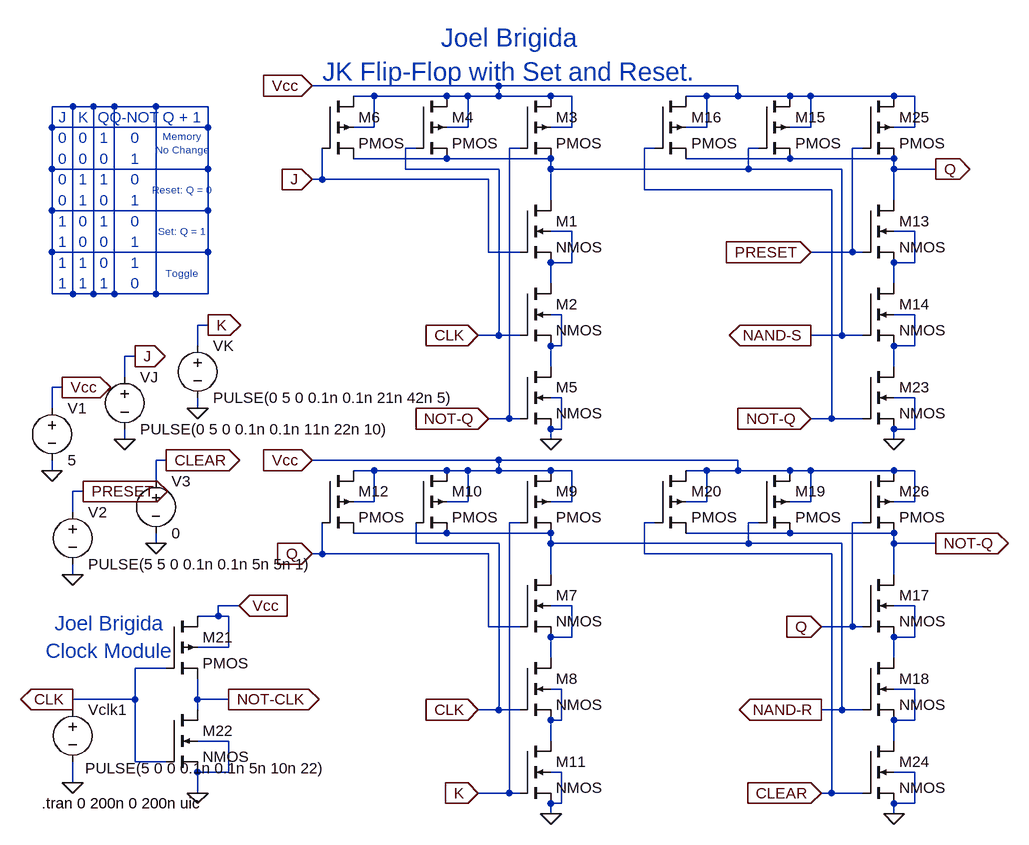
[diagram p0: schematic JKFlipFlop.asc]
JKFlipFlop.asc, the LTspice schematic file:
Version 4
SHEET 1 880 876
WIRE -288 -256 -576 -256
WIRE 80 -256 -288 -256
WIRE -480 -240 -512 -240
WIRE -368 -240 -480 -240
WIRE -336 -240 -368 -240
WIRE -288 -240 -288 -256
WIRE -288 -240 -336 -240
WIRE -208 -240 -288 -240
WIRE -176 -240 -208 -240
WIRE 32 -240 0 -240
WIRE 80 -240 80 -256
WIRE 80 -240 32 -240
WIRE 160 -240 80 -240
WIRE 192 -240 160 -240
WIRE 320 -240 192 -240
WIRE 352 -240 320 -240
WIRE -944 -224 -976 -224
WIRE -912 -224 -944 -224
WIRE -880 -224 -912 -224
WIRE -816 -224 -880 -224
WIRE -736 -224 -816 -224
WIRE -976 -192 -976 -224
WIRE -736 -192 -736 -224
WIRE -736 -192 -976 -192
WIRE -480 -192 -480 -240
WIRE -480 -192 -512 -192
WIRE -336 -192 -336 -240
WIRE -336 -192 -368 -192
WIRE -176 -192 -176 -240
WIRE -176 -192 -208 -192
WIRE 32 -192 32 -240
WIRE 32 -192 0 -192
WIRE 192 -192 192 -240
WIRE 192 -192 160 -192
WIRE 352 -192 352 -240
WIRE 352 -192 320 -192
WIRE -416 -160 -432 -160
WIRE -256 -160 -272 -160
WIRE -48 -160 -64 -160
WIRE 112 -160 96 -160
WIRE 272 -160 256 -160
WIRE -368 -144 -512 -144
WIRE -208 -144 -368 -144
WIRE 160 -144 0 -144
WIRE 320 -144 160 -144
WIRE -976 -128 -976 -192
WIRE -736 -128 -736 -192
WIRE -736 -128 -976 -128
WIRE -432 -128 -432 -160
WIRE -288 -128 -432 -128
WIRE -208 -128 -208 -144
WIRE 96 -128 96 -160
WIRE 96 -128 -208 -128
WIRE 240 -128 96 -128
WIRE 320 -128 320 -144
WIRE 384 -128 320 -128
WIRE -560 -112 -560 -160
WIRE -560 -112 -576 -112
WIRE -304 -112 -560 -112
WIRE -64 -96 -64 -160
WIRE 224 -96 -64 -96
WIRE -208 -80 -208 -128
WIRE 320 -80 320 -128
WIRE -976 -64 -976 -128
WIRE -736 -64 -736 -128
WIRE -736 -64 -976 -64
WIRE -176 -32 -208 -32
WIRE 352 -32 320 -32
WIRE -976 0 -976 -64
WIRE -736 0 -736 -64
WIRE -736 0 -976 0
WIRE -304 0 -304 -112
WIRE -256 0 -304 0
WIRE 256 0 256 -160
WIRE 256 0 192 0
WIRE 272 0 256 0
WIRE -176 16 -176 -32
WIRE -176 16 -208 16
WIRE 352 16 352 -32
WIRE 352 16 320 16
WIRE -208 48 -208 16
WIRE 320 48 320 16
WIRE -976 64 -976 0
WIRE -944 64 -944 -224
WIRE -944 64 -976 64
WIRE -912 64 -912 -224
WIRE -912 64 -944 64
WIRE -880 64 -880 -224
WIRE -880 64 -912 64
WIRE -816 64 -816 -224
WIRE -816 64 -880 64
WIRE -736 64 -736 0
WIRE -736 64 -816 64
WIRE -192 96 -208 96
WIRE 352 96 320 96
WIRE -736 112 -752 112
WIRE -288 128 -288 -128
WIRE -288 128 -320 128
WIRE -256 128 -288 128
WIRE 240 128 240 -128
WIRE 240 128 192 128
WIRE 272 128 240 128
WIRE -752 144 -752 112
WIRE -192 144 -192 96
WIRE -192 144 -208 144
WIRE 352 144 352 96
WIRE 352 144 320 144
WIRE -848 160 -864 160
WIRE -208 176 -208 144
WIRE 320 176 320 144
WIRE -864 192 -864 160
WIRE -960 208 -976 208
WIRE -192 224 -208 224
WIRE 352 224 320 224
WIRE -976 240 -976 208
WIRE -752 240 -752 224
WIRE -272 256 -272 -160
WIRE -272 256 -304 256
WIRE -256 256 -272 256
WIRE 224 256 224 -96
WIRE 224 256 192 256
WIRE 272 256 224 256
WIRE -192 272 -192 224
WIRE -192 272 -208 272
WIRE 352 272 352 224
WIRE 352 272 320 272
WIRE -864 288 -864 272
WIRE -208 288 -208 272
WIRE 320 288 320 272
WIRE -800 320 -816 320
WIRE -288 320 -576 320
WIRE 80 320 -288 320
WIRE -976 336 -976 320
WIRE -480 336 -512 336
WIRE -368 336 -480 336
WIRE -336 336 -368 336
WIRE -288 336 -288 320
WIRE -288 336 -336 336
WIRE -208 336 -288 336
WIRE -176 336 -208 336
WIRE 32 336 0 336
WIRE 80 336 80 320
WIRE 80 336 32 336
WIRE 160 336 80 336
WIRE 192 336 160 336
WIRE 320 336 192 336
WIRE 352 336 320 336
WIRE -816 352 -816 320
WIRE -928 368 -944 368
WIRE -480 384 -480 336
WIRE -480 384 -512 384
WIRE -336 384 -336 336
WIRE -336 384 -368 384
WIRE -176 384 -176 336
WIRE -176 384 -208 384
WIRE 32 384 32 336
WIRE 32 384 0 384
WIRE 192 384 192 336
WIRE 192 384 160 384
WIRE 352 384 352 336
WIRE 352 384 320 384
WIRE -944 400 -944 368
WIRE -256 416 -272 416
WIRE -48 416 -64 416
WIRE 112 416 96 416
WIRE 272 416 256 416
WIRE -368 432 -512 432
WIRE -208 432 -368 432
WIRE 160 432 0 432
WIRE 320 432 160 432
WIRE -816 448 -816 432
WIRE -416 448 -416 416
WIRE -288 448 -416 448
WIRE -208 448 -208 432
WIRE 96 448 96 416
WIRE 96 448 -208 448
WIRE 240 448 96 448
WIRE 320 448 320 432
WIRE 384 448 320 448
WIRE -560 464 -560 416
WIRE -560 464 -576 464
WIRE -304 464 -560 464
WIRE -64 464 -64 416
WIRE 224 464 -64 464
WIRE -944 496 -944 480
WIRE -208 496 -208 448
WIRE 320 496 320 448
WIRE -688 544 -720 544
WIRE -176 544 -208 544
WIRE 352 544 320 544
WIRE -720 560 -720 544
WIRE -720 560 -752 560
WIRE -704 560 -720 560
WIRE -304 576 -304 464
WIRE -256 576 -304 576
WIRE 256 576 256 416
WIRE 256 576 208 576
WIRE 272 576 256 576
WIRE -176 592 -176 544
WIRE -176 592 -208 592
WIRE 352 592 352 544
WIRE 352 592 320 592
WIRE -704 608 -704 560
WIRE -704 608 -752 608
WIRE -208 624 -208 592
WIRE 320 624 320 592
WIRE -800 640 -848 640
WIRE -192 672 -208 672
WIRE 352 672 320 672
WIRE -848 688 -848 640
WIRE -848 688 -944 688
WIRE -752 688 -752 656
WIRE -704 688 -752 688
WIRE -944 704 -944 688
WIRE -752 704 -752 688
WIRE -288 704 -288 448
WIRE -288 704 -320 704
WIRE -256 704 -288 704
WIRE 240 704 240 448
WIRE 240 704 208 704
WIRE 272 704 240 704
WIRE -192 720 -192 672
WIRE -192 720 -208 720
WIRE 352 720 352 672
WIRE 352 720 320 720
WIRE -704 752 -752 752
WIRE -208 752 -208 720
WIRE 320 752 320 720
WIRE -848 784 -848 688
WIRE -800 784 -848 784
WIRE -704 800 -704 752
WIRE -704 800 -752 800
WIRE -192 800 -208 800
WIRE 352 800 320 800
WIRE -944 816 -944 784
WIRE -752 832 -752 800
WIRE -272 832 -272 416
WIRE -272 832 -320 832
WIRE -256 832 -272 832
WIRE 224 832 224 464
WIRE 224 832 208 832
WIRE 272 832 224 832
WIRE -192 848 -192 800
WIRE -192 848 -208 848
WIRE 352 848 352 800
WIRE 352 848 320 848
WIRE -208 864 -208 848
WIRE 320 864 320 848
FLAG -208 288 0
FLAG -208 864 0
FLAG -576 -112 J
IOPIN -576 -112 In
FLAG -320 128 CLK
IOPIN -320 128 In
FLAG -304 256 NOT-Q
IOPIN -304 256 In
FLAG -576 320 Vcc
IOPIN -576 320 In
FLAG -576 -256 Vcc
IOPIN -576 -256 In
FLAG -576 464 Q
IOPIN -576 464 In
FLAG -320 704 CLK
IOPIN -320 704 In
FLAG -320 832 K
IOPIN -320 832 In
FLAG 384 -128 Q
IOPIN 384 -128 Out
FLAG 384 448 NOT-Q
IOPIN 384 448 Out
FLAG -976 336 0
FLAG -960 208 Vcc
IOPIN -960 208 Out
FLAG -752 832 0
FLAG -944 816 0
FLAG -944 688 CLK
IOPIN -944 688 Out
FLAG -704 688 NOT-CLK
IOPIN -704 688 Out
FLAG -688 544 Vcc
IOPIN -688 544 In
FLAG -752 240 0
FLAG -864 288 0
FLAG -848 160 J
IOPIN -848 160 Out
FLAG -736 112 K
IOPIN -736 112 Out
FLAG 320 288 0
FLAG 320 864 0
FLAG 192 0 PRESET
IOPIN 192 0 In
FLAG 208 832 CLEAR
IOPIN 208 832 In
FLAG 208 704 NAND-R
IOPIN 208 704 Out
FLAG 192 128 NAND-S
IOPIN 192 128 Out
FLAG 192 256 NOT-Q
IOPIN 192 256 In
FLAG 208 576 Q
IOPIN 208 576 In
FLAG -816 448 0
FLAG -944 496 0
FLAG -800 320 CLEAR
IOPIN -800 320 Out
FLAG -928 368 PRESET
IOPIN -928 368 Out
SYMBOL nmos4 -256 -80 R0
SYMATTR InstName M1
SYMBOL nmos4 -256 48 R0
SYMATTR InstName M2
SYMBOL pmos4 -256 -240 R0
SYMATTR InstName M3
SYMBOL pmos4 -416 -240 R0
SYMATTR InstName M4
SYMBOL nmos4 -256 176 R0
SYMATTR InstName M5
SYMBOL pmos4 -560 -240 R0
SYMATTR InstName M6
SYMBOL nmos4 -256 496 R0
SYMATTR InstName M7
SYMBOL nmos4 -256 624 R0
SYMATTR InstName M8
SYMBOL pmos4 -256 336 R0
SYMATTR InstName M9
SYMBOL pmos4 -416 336 R0
SYMATTR InstName M10
SYMBOL nmos4 -256 752 R0
SYMATTR InstName M11
SYMBOL pmos4 -560 336 R0
SYMATTR InstName M12
SYMBOL nmos4 272 -80 R0
SYMATTR InstName M13
SYMBOL nmos4 272 48 R0
SYMATTR InstName M14
SYMBOL pmos4 112 -240 R0
SYMATTR InstName M15
SYMBOL pmos4 -48 -240 R0
SYMATTR InstName M16
SYMBOL nmos4 272 496 R0
SYMATTR InstName M17
SYMBOL nmos4 272 624 R0
SYMATTR InstName M18
SYMBOL pmos4 112 336 R0
SYMATTR InstName M19
SYMBOL pmos4 -48 336 R0
SYMATTR InstName M20
SYMBOL voltage -976 224 R0
WINDOW 123 0 0 Left 0
WINDOW 39 0 0 Left 0
SYMATTR InstName V1
SYMATTR Value 5
SYMBOL pmos4 -800 560 R0
SYMATTR InstName M21
SYMBOL nmos4 -800 704 R0
SYMATTR InstName M22
SYMBOL voltage -944 688 R0
WINDOW 3 19 106 Left 2
WINDOW 123 0 0 Left 0
WINDOW 39 0 0 Left 0
SYMATTR Value PULSE(5 0 0 0.1n 0.1n 5n 10n 22)
SYMATTR InstName Vclk1
SYMBOL voltage -864 176 R0
WINDOW 123 0 0 Left 0
WINDOW 39 0 0 Left 0
SYMATTR InstName VJ
SYMATTR Value PULSE(0 5 0 0.1n 0.1n 11n 22n 10)
SYMBOL voltage -752 128 R0
WINDOW 123 0 0 Left 0
WINDOW 39 0 0 Left 0
SYMATTR InstName VK
SYMATTR Value PULSE(0 5 0 0.1n 0.1n 21n 42n 5)
SYMBOL nmos4 272 176 R0
SYMATTR InstName M23
SYMBOL nmos4 272 752 R0
SYMATTR InstName M24
SYMBOL pmos4 272 -240 R0
SYMATTR InstName M25
SYMBOL pmos4 272 336 R0
SYMATTR InstName M26
SYMBOL voltage -944 384 R0
WINDOW 123 0 0 Left 0
WINDOW 39 0 0 Left 0
SYMATTR InstName V2
SYMATTR Value PULSE(5 5 0 0.1n 0.1n 5n 5n 1)
SYMBOL voltage -816 336 R0
WINDOW 123 0 0 Left 0
WINDOW 39 0 0 Left 0
SYMATTR InstName V3
SYMATTR Value 0
TEXT -960 -208 Center 2 ;J
TEXT -928 -208 Center 2 ;K
TEXT -896 -208 Center 2 ;Q
TEXT -848 -208 Center 2 ;Q-NOT
TEXT -960 -176 Center 2 ;0
TEXT -960 -144 Center 2 ;0
TEXT -928 -176 Center 2 ;0
TEXT -928 -144 Center 2 ;0
TEXT -848 -176 Center 2 ;0
TEXT -896 -144 Center 2 ;0
TEXT -960 -112 Center 2 ;0
TEXT -848 -48 Center 2 ;0
TEXT -848 -112 Center 2 ;0
TEXT -896 -176 Center 2 ;1
TEXT -848 -144 Center 2 ;1
TEXT -928 -112 Center 2 ;1
TEXT -960 -80 Center 2 ;0
TEXT -928 -80 Center 2 ;1
TEXT -896 -80 Center 2 ;0
TEXT -848 -80 Center 2 ;1
TEXT -960 -48 Center 2 ;1
TEXT -928 -48 Center 2 ;0
TEXT -960 16 Center 2 ;1
TEXT -928 16 Center 2 ;1
TEXT -848 16 Center 2 ;1
TEXT -960 48 Center 2 ;1
TEXT -928 48 Center 2 ;1
TEXT -896 48 Center 2 ;1
TEXT -848 48 Center 2 ;0
TEXT -896 -112 Center 2 ;1
TEXT -896 -48 Center 2 ;1
TEXT -896 16 Center 2 ;0
TEXT -960 -16 Center 2 ;1
TEXT -928 -16 Center 2 ;0
TEXT -848 -16 Center 2 ;1
TEXT -896 -16 Center 2 ;0
TEXT -776 -208 Center 2 ;Q + 1
TEXT -776 -168 Center 1 ;Memory\nNo Change
TEXT -776 -96 Center 1 ;Reset: Q = 0
TEXT -776 -32 Center 1 ;Set: Q = 1
TEXT -776 32 Center 1 ;Toggle
TEXT -272 -304 Center 4 ;Joel Brigida\nJK Flip-Flop with Set and Reset.
TEXT -888 592 Center 3 ;Joel Brigida\nClock Module
TEXT -992 848 Left 2 !.tran 0 200n 0 200n uic

The netlist it stands for:
* JKFlipFlop.asc
M1 NAND-S J N002 N002 NMOS
M2 N002 CLK N004 N004 NMOS
M3 Vcc NOT-Q NAND-S Vcc PMOS
M4 Vcc CLK NAND-S Vcc PMOS
M5 N004 NOT-Q 0 0 NMOS
M6 Vcc J NAND-S Vcc PMOS
M7 NAND-R Q N006 N006 NMOS
M8 N006 CLK N008 N008 NMOS
M9 Vcc K NAND-R Vcc PMOS
M10 Vcc CLK NAND-R Vcc PMOS
M11 N008 K 0 0 NMOS
M12 Vcc Q NAND-R Vcc PMOS
M13 Q PRESET N003 N003 NMOS
M14 N003 NAND-S N005 N005 NMOS
M15 Vcc NAND-S Q Vcc PMOS
M16 Vcc NOT-Q Q Vcc PMOS
M17 NOT-Q Q N007 N007 NMOS
M18 N007 NAND-R N009 N009 NMOS
M19 Vcc NAND-R NOT-Q Vcc PMOS
M20 Vcc CLEAR NOT-Q Vcc PMOS
V1 Vcc 0 5
M21 Vcc CLK NOT-CLK Vcc PMOS
M22 NOT-CLK CLK 0 0 NMOS
Vclk1 CLK 0 PULSE(5 0 0 0.1n 0.1n 5n 10n 22)
VJ J 0 PULSE(0 5 0 0.1n 0.1n 11n 22n 10)
VK K 0 PULSE(0 5 0 0.1n 0.1n 21n 42n 5)
M23 N005 NOT-Q 0 0 NMOS
M24 N009 CLEAR 0 0 NMOS
M25 Vcc PRESET Q Vcc PMOS
M26 Vcc Q NOT-Q Vcc PMOS
V2 PRESET 0 PULSE(5 5 0 0.1n 0.1n 5n 5n 1)
V3 CLEAR 0 0
.model NMOS NMOS
.model PMOS PMOS
.lib standard.mos
* J
* K
* Q
* Q-NOT
* 0
* 0
* 0
* 0
* 0
* 0
* 0
* 0
* 0
* 1
* 1
* 1
* 0
* 1
* 0
* 1
* 1
* 0
* 1
* 1
* 1
* 1
* 1
* 1
* 0
* 1
* 1
* 0
* 1
* 0
* 1
* 0
* Q + 1
* Memory
* No Change
* Reset: Q = 0
* Set: Q = 1
* Toggle
* Joel Brigida
* JK Flip-Flop with Set and Reset.
* Joel Brigida
* Clock Module
.tran 0 200n 0 200n uic
.backanno
.end